# EAGLE design Breakout (EAGLE 6.2)
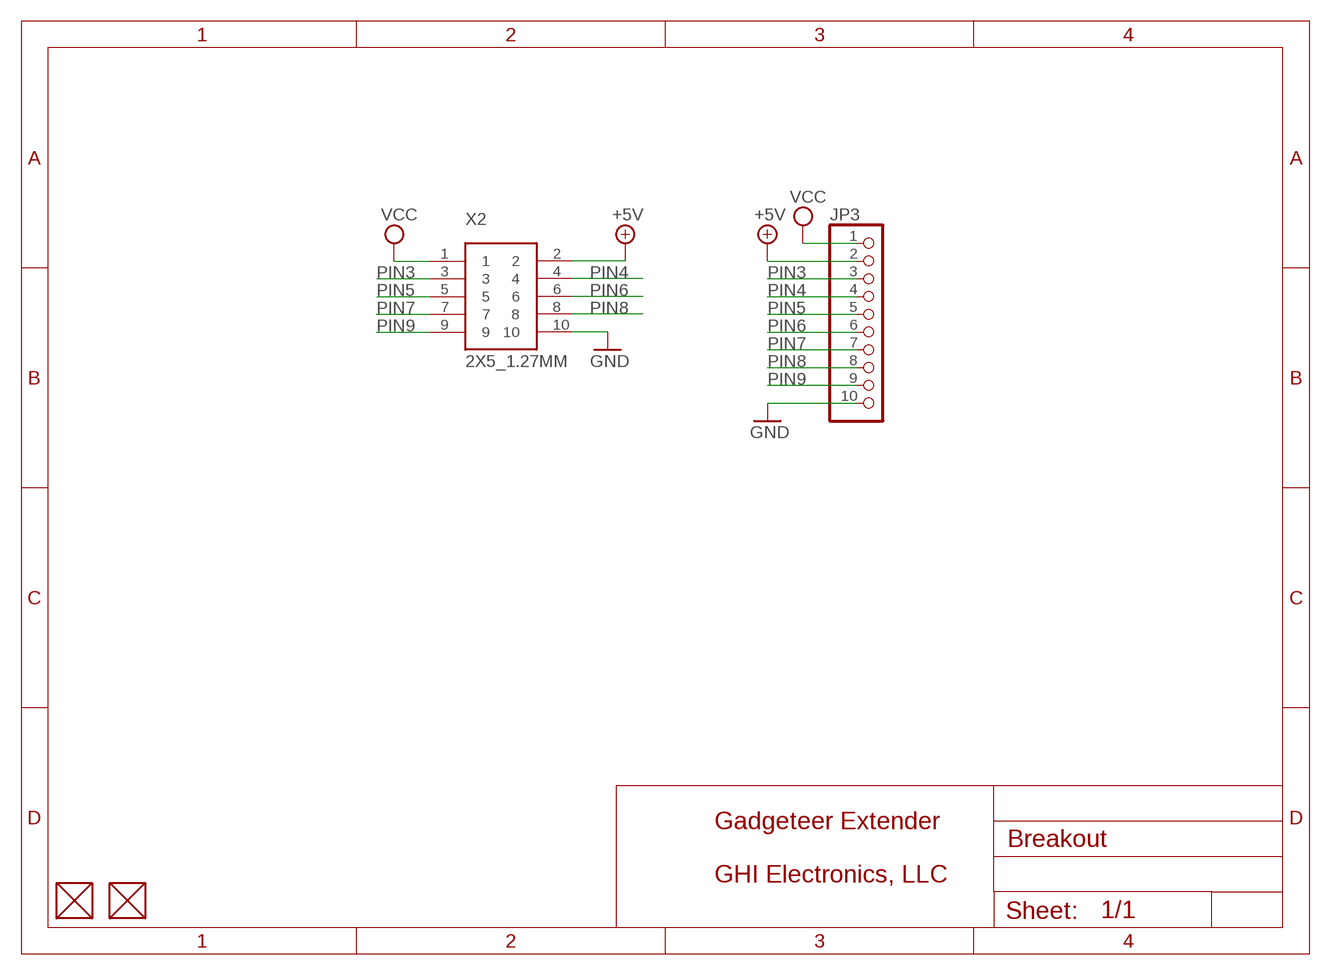
[diagram p0: schematic, sheet 1]

## Parts
FUD1  FIDUCIAL  [FIDUCIAL_40MIL]
FUD2  FIDUCIAL  [FIDUCIAL_40MIL]
JP3  PINHD-1X10  [1X10]
X2  2X5_1.27MM  [2X5_1.27MM]

## Nets
+5V [power]: JP3.2 X2.2
GND [power]: JP3.10 X2.10
PIN3: JP3.3 X2.3
PIN4: JP3.4 X2.4
PIN5: JP3.5 X2.5
PIN6: JP3.6 X2.6
PIN7: JP3.7 X2.7
PIN8: JP3.8 X2.8
PIN9: JP3.9 X2.9
VCC [power]: JP3.1 X2.1
Unconnected: FUD1.P$1 FUD2.P$1

## Notes on the sheet
- Gadgeteer Extender
- GHI Electronics, LLC

## Library data of the parts
FUD1 FUD2 = GHI:FIDUCIAL
JP3 = pinhead:PINHD-1X10: PIN HEADER
X2 = GHI:2X5_1.27MM

## Net classes
0 default: width 0.254 mm, drill 0.381 mm, clearance 0.203 mm

## Board
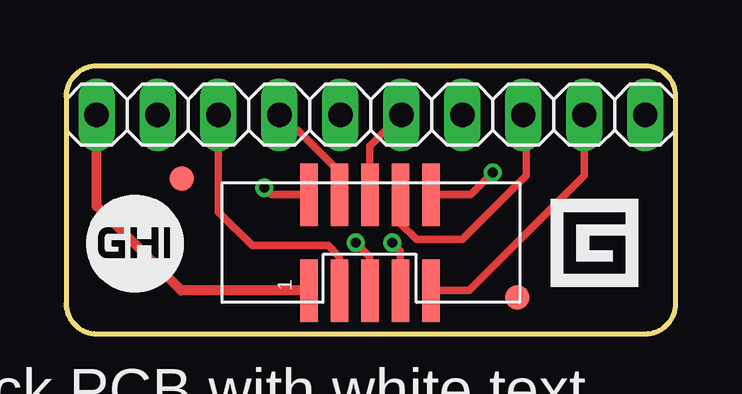
[diagram p1: board, top side]
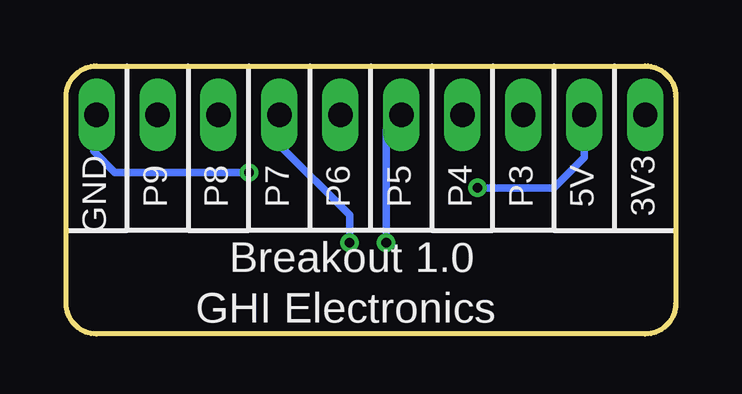
[diagram p2: board, bottom side, seen from below]

Size 25.4 x 11.18 mm. Coordinates in mm from the lower left corner, seen from the top.
Outline: 1.27,0 24.13,0 arc90 25.4,1.27 25.4,9.91 arc90 24.13,11.18 1.27,11.18 arc90 0,9.91 0,1.27 arc90 1.27,0
Copper layers (1+16): Top 0.035mm / dielectric 1.5mm / Bottom 0.035mm
Design rules: minimum track width 8mil, minimum drill 12mil, track to track 8mil, track to pad 8mil, pad to pad 8mil, via to via 8mil, smd to smd 8mil, copper to edge 15mil, drill to drill 8mil, minimum pad ring 10mil, minimum via ring 7mil, stop-mask expansion 4mil, vias tented up to drill 50mil, thermal gap 10mil

### Footprints (pad centres in the part's own frame; a part is rotated, then mirrored left to right if it is on the bottom)
FIDUCIAL_40MIL = smd 1.016 x 1.016: P$1 0,0
1X10 = drill 1.016 long: 1 -11.43,0; 2 -8.89,0; 3 -6.35,0; 4 -3.81,0; 5 -1.27,0; 6 1.27,0; 7 3.81,0; 8 6.35,0; 9 8.89,0; 10 11.43,0
2X5_1.27MM = smd 2.6 x 0.74: 1 -2,2.58; 2 2,2.58; 3 -2,1.31; 4 2,1.31; 5 -2,0.04; 6 2,0.04; 7 -2,-1.23; 8 2,-1.23; 9 -2,-2.5; 10 2,-2.5

### Placement (x,y rotation side)
FUD1  18.8,1.52 0 top
FUD2  4.83,6.48 0 top
JP3  12.7,9.14 0 top
X2  12.7,3.81 90 top

### Tracks (layer width: path | path; a pad name or v marks a point on that pad's centre or on a via)
+5V  (via drill 0.41)
  Top 0.305: X2.2 8.54,5.81 v8.26,6.1
  Bottom 0.305: v8.26,6.1 5.08,6.1 3.81,7.37 JP3.2
GND  (via drill 0.41)
  Top 0.305: X2.10 16.86,5.81 v17.78,6.73
  Bottom 0.305: v17.78,6.73 23.37,6.73 24.26,7.62 24.26,9.02 JP3.10
PIN3
  Top 0.305: X2.3 11.39,3.21 10.92,3.68 7.75,3.68 6.35,5.08 JP3.3
PIN4
  Top 0.305: X2.4 11.39,6.77 9.65,8.51 9.53,8.51 JP3.4
PIN5  (via drill 0.41)
  Top 0.305: X2.5 12.66,3.21 v12.06,3.81
  Bottom 0.305: v12.06,3.81 12.06,8.51 JP3.5
PIN6
  Top 0.305: X2.6 12.66,7.83 JP3.6
PIN7  (via drill 0.41)
  Top 0.305: X2.7 13.93,3.47 v13.59,3.81
  Bottom 0.305: v13.59,3.81 13.59,4.95 16.51,7.87 JP3.7
PIN8
  Top 0.305: X2.8 13.93,4.61 14.61,3.94 16.51,3.94 19.18,6.6 19.18,9.02 JP3.8
PIN9
  Top 0.305: X2.9 16.8,1.81 21.59,6.6 JP3.9
VCC
  Top 0.406: X2.1 4.79,1.81 1.27,5.33 JP3.1

### Text on the board
tPlace: black PCB with white text | do not add manufacturing codes
bPlace: 3V3 | 5V | P3 | P4 | P5 | P6 | P7 | P8 | P9 | GND | Breakout 1.0 | GHI Electronics